# EAGLE schematic ZumoAdapterboardv2 (EAGLE 6.6.0)
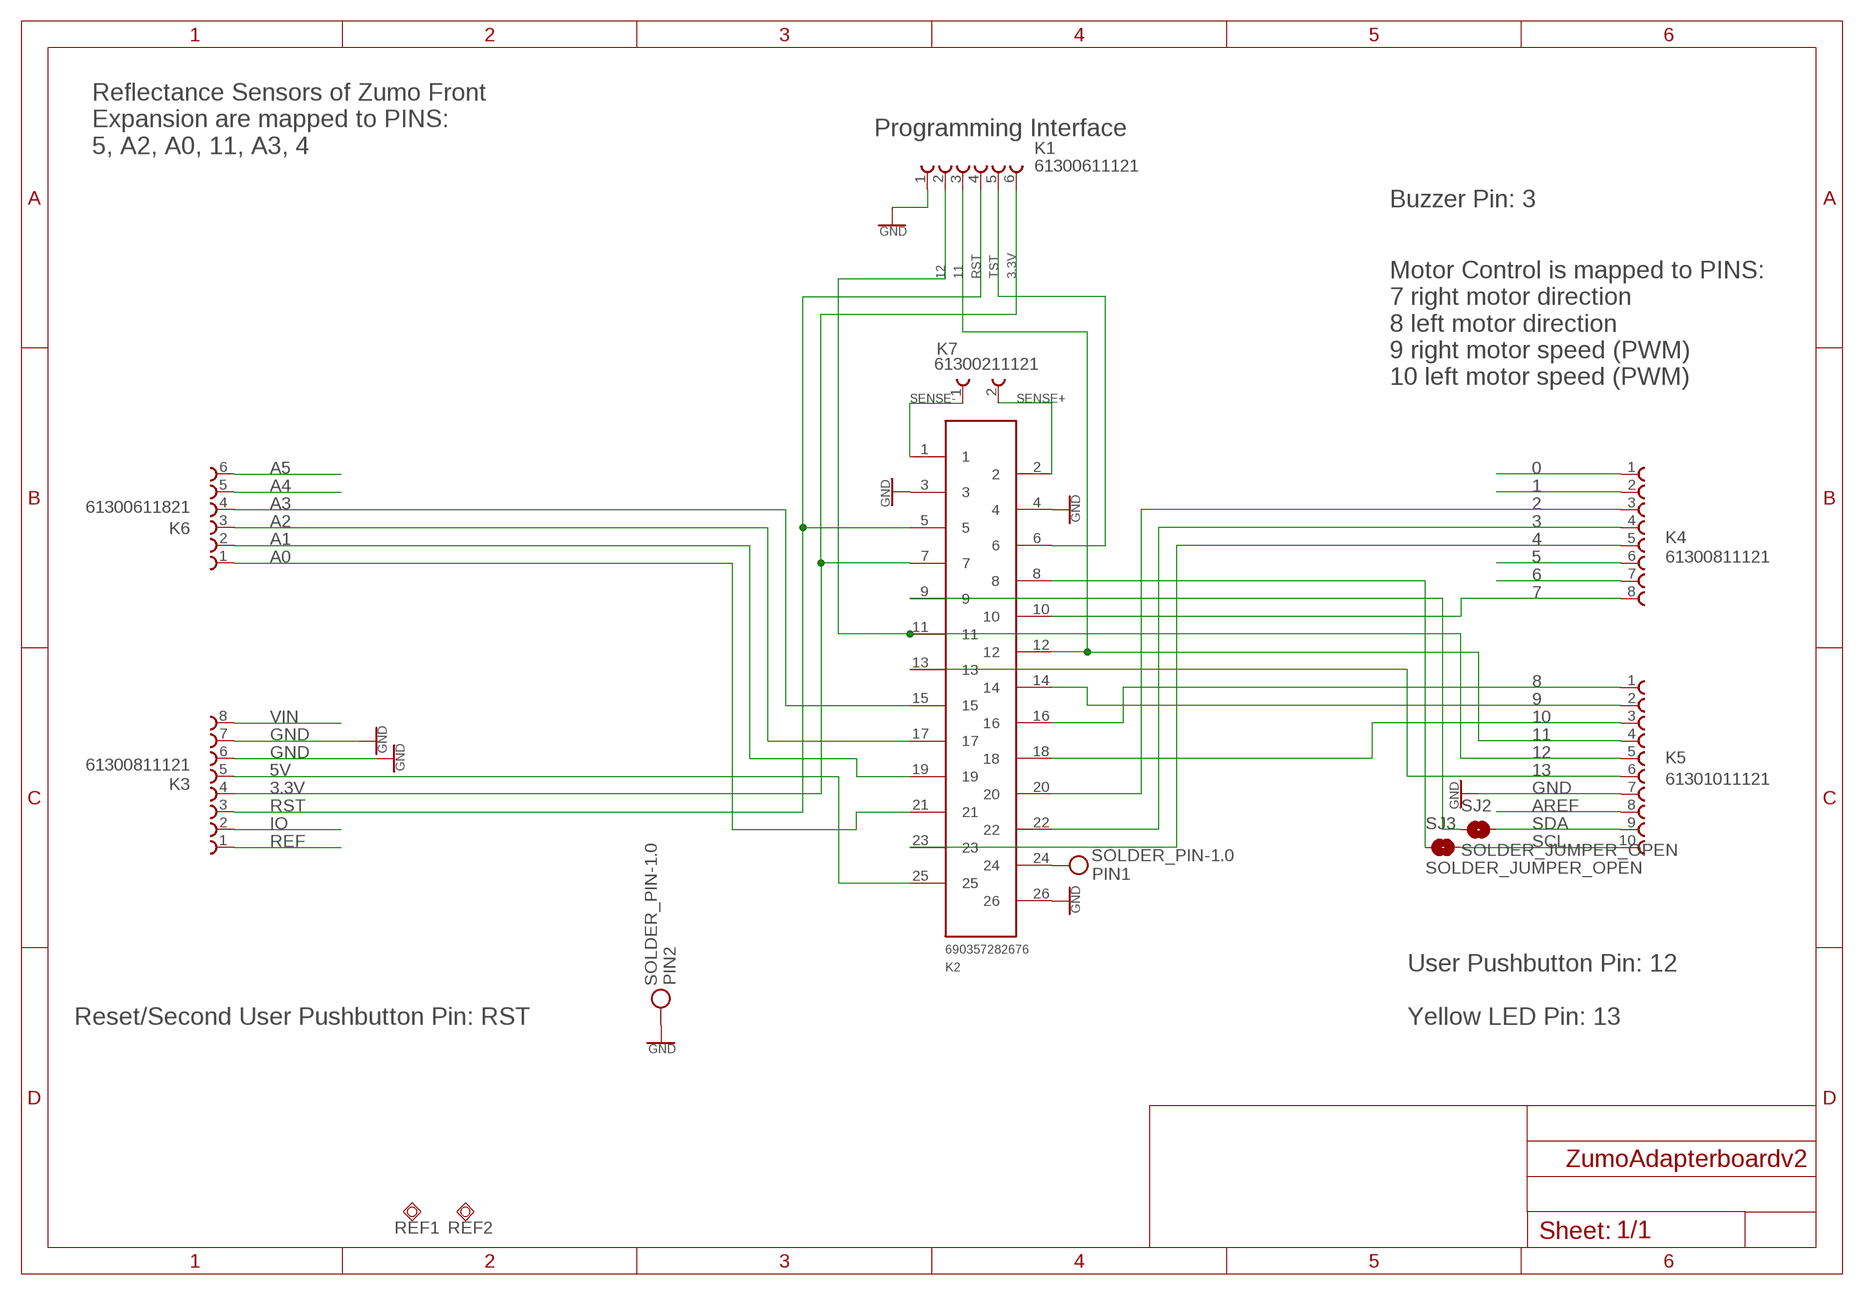
[diagram p0: schematic, sheet 1]

## Parts
K1  61300611121  [61300611121]
K2  690357282676  [690357282676]
K3  61300811121  [61300811121]
K4  61300811121  [61300811121]
K5  61301011121  [61301011121]
K6  61300611821  [61300611821]
K7  61300211121  [61300211121]
PIN1  SOLDER_PIN-1.0  [SOLDER_PIN_1.0]
PIN2  SOLDER_PIN-1.0  [SOLDER_PIN_1.0]
REF1  PCB-REF-1.27  [PCB-REF]
REF2  PCB-REF-1.27  [PCB-REF]
SJ2  SOLDER_JUMPER_OPEN  [SJ-O]
SJ3  SOLDER_JUMPER_OPEN  [SJ-O]

## Nets
0: K4.1
1: K4.2
2: K2.20 K4.3
3: K2.22 K4.4
3.3V: K1.6 K2.7 K3.4
4: K2.23 K4.5
5: K4.6
5V: K2.25 K3.5
6: K4.7
7: K2.10 K4.8
8: K2.16 K5.1
9: K2.14 K5.2
10: K2.18 K5.3
11: K1.3 K2.12 K5.4
12: K1.2 K2.11 K5.5
13: K2.13 K5.6
A0: K2.21 K6.1
A1: K2.19 K6.2
A2: K2.17 K6.3
A3: K2.15 K6.4
A4: K6.5
A5: K6.6
AREF: K5.8
GND: K1.1 K2.3 K2.4 K2.26 K3.6 K3.7 K5.7 PIN2._(PIN)
IO: K3.2
N$1: K2.24 PIN1._(PIN)
N$2: K2.8 SJ3.1
N$3: K2.9 SJ2.1
REF: K3.1
RST: K1.4 K2.5 K3.3
SCL: K5.10 SJ3.2
SDA: K5.9 SJ2.2
SENSE+ [sens]: K2.2 K7.2
SENSE- [sens]: K2.1 K7.1
TST: K1.5 K2.6
VIN: K3.8
Unconnected: REF1.0(PP) REF2.0(PP)

## Notes on the sheet
- Programming Interface
- Reflectance Sensors of Zumo Front
  Expansion are mapped to PINS:
  5, A2, A0, 11, A3, 4
- Buzzer Pin: 3
- Motor Control is mapped to PINS:
  7 right motor direction
  8 left motor direction
  9 right motor speed (PWM)
  10 left motor speed (PWM)
- User Pushbutton Pin: 12
- Reset/Second User Pushbutton Pin: RST | Yellow LED Pin: 13

## Library data of the parts
K1 = MasterPhonebot:61300611121: WR-PHD 2.54mm Pin Header, 6 Pin =>Code : Con_BTB_PHD_2.54_1_THT_61300611121 <http://katalog.we-online.de/media/images/eican/Con_BTB_PHD_2.54_1_THT_6130xx11121_pf2.jpg> Details see: http://katalog.we-online.de/en/em/613_0xx_111_21 Created 2014-05-29, Karrer Zheng 2014 (C) Würth Elektronik
K2 = MasterPhonebot:690357282676: WR-MM Male SMT Connector without Latch and without Polarization, 26 pins=>Code : Con_BTB_MM_SMT_690357282676 <http://katalog.we-online.de/media/thumbs2/eican/thb_Con_BTB_MM_SMT_69035728xx76_pf2.jpg> Details see: http://katalog.we-online.de/en/em/6903_5728_xx_76 Created 2014-06-04, Karrer Zheng 2014 (C) Würth Elektronik
K3 K4 = MasterPhonebot:61300811121: WR-PHD 5.54mm Pin Header, 8 Pins =>Code : Con_BTB_PHD_2.54_1_THT_61300811121 <http://katalog.we-online.de/media/images/eican/Con_BTB_PHD_2.54_1_THT_6130xx11121_pf2.jpg> Details see: http://katalog.we-online.de/en/em/613_0xx_111_21 Created 2014-05-29, Karrer Zheng 2014 (C) Würth Elektronik
K5 = MasterPhonebot:61301011121: WR-PHD 2.54mm Pin Header, 10 Pins =>Code : Con_BTB_PHD_2.54_1_THT_61301011121 <http://katalog.we-online.de/media/images/eican/Con_BTB_PHD_2.54_1_THT_6130xx11121_pf2.jpg> Details see: http://katalog.we-online.de/en/em/613_0xx_111_21 Created 2014-05-29, Karrer Zheng 2014 (C) Würth Elektronik
K6 = MasterPhonebot:61300611821: WR-PHD 2.54mm Socket Header, 6 Pins =>Code : Con_BTB_SHD_2.54_1_THT_61300611821 <http://katalog.we-online.de/media/images/eican/Con_BTB_SHD_2.54_1_THT_6130xx11821_pf2.jpg> Details see: http://katalog.we-online.de/en/em/613_0xx_118_21 Created 2014-05-29, Karrer Zheng 2014 (C) Würth Elektronik
K7 = MasterPhonebot:61300211121: WR-PHD 2.54mm Pin Header, 2 Pin=>Code : Con_BTB_PHD_2.54_1_THT_61300211121 <http://katalog.we-online.de/media/images/eican/Con_BTB_PHD_2.54_1_THT_6130xx11121_pf2.jpg> Details see: http://katalog.we-online.de/en/em/613_0xx_111_21 Created 2014-05-29, Karrer Zheng 2014 (C) Würth Elektronik
PIN1 PIN2 = MasterPhonebot:SOLDER_PIN: Simple Solder pin Created G. Klenner, 2013 (C) K&K Prime Engineering GmbH
REF1 REF2 = MasterPhonebot:PCB-REF: reference point for PCB population Created G. Klenner, 2011-09-21 (c) K&K Prime Engineering GmbH
SJ2 SJ3 = MasterPhonebot:SOLDER_JUMPER: SMD solder JUMPER

## Net classes
1 sens: width 0.3 mm, drill 0.6 mm, clearance 1.016 mm